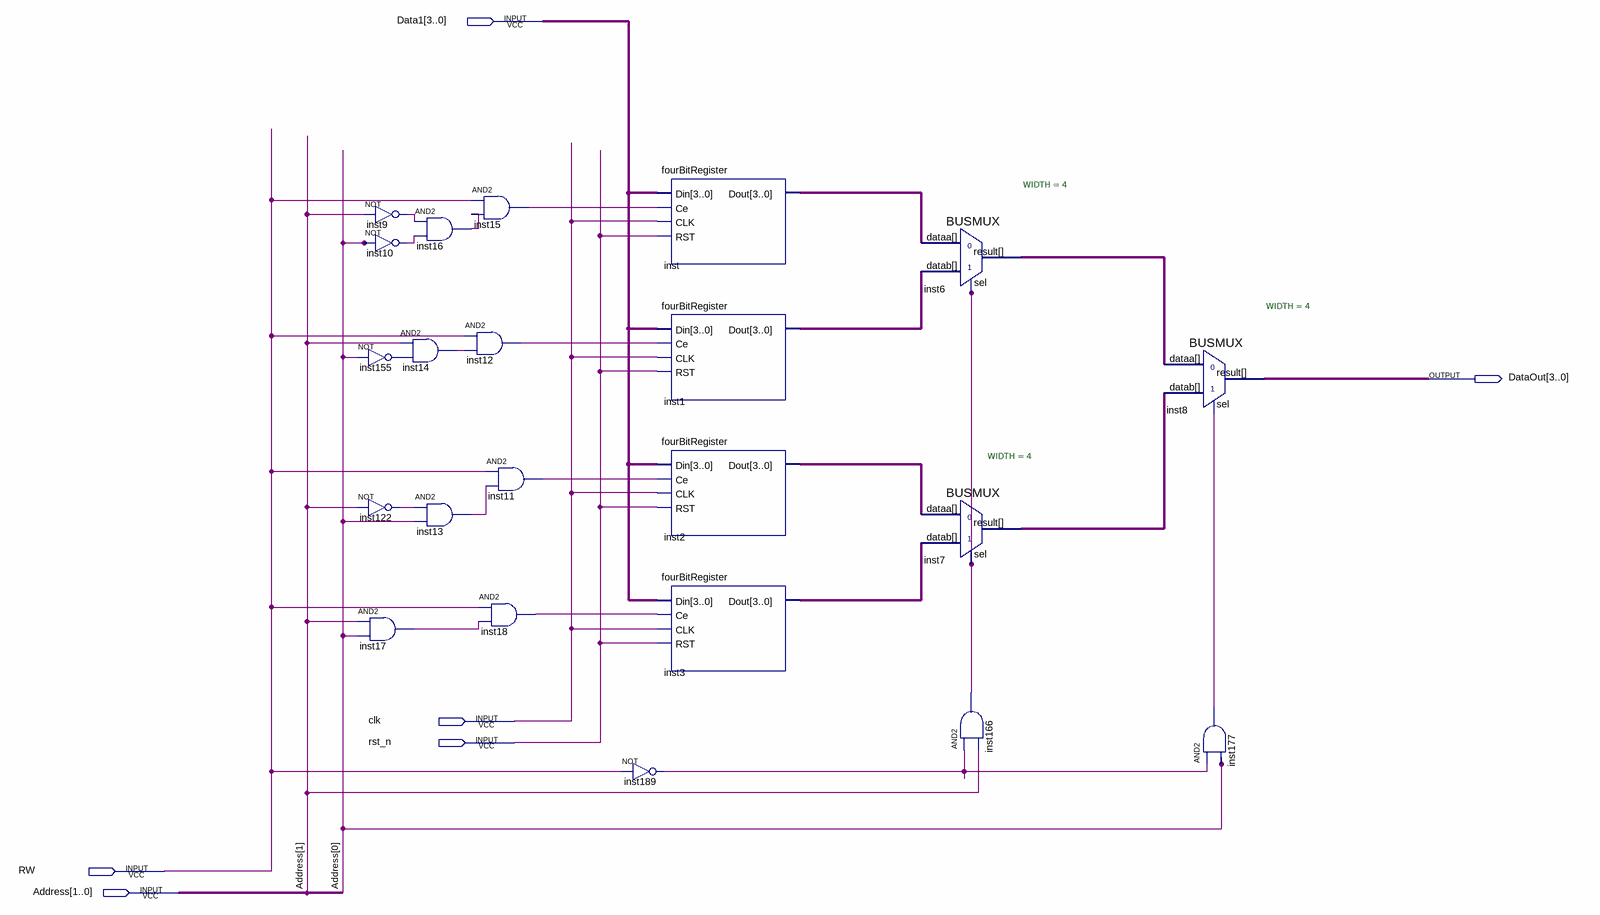
[diagram p0: schematic sheet]
// Quartus schematic ex2.bdf as structural Verilog: 22 symbols, 6 pins
module ex2 (
  input  [3:0] Data1,
  input  clk,
  input  rst_n,
  input  RW,
  input  [1:0] Address,
  output [3:0] DataOut
);

  wire inst9_out, inst10_out, inst11_out, inst12_out, inst13_out, inst14_out, inst15_out, inst16_out,
       inst17_out, inst18_out, inst122_out, inst155_out, inst166_out, inst177_out, inst189_out;
  wire [3:0] inst1_dout, inst2_dout, inst3_dout, inst6_result, inst7_result, inst_dout;

  not inst9 (inst9_out, Address[1]);
  not inst10 (inst10_out, Address[0]);
  not inst155 (inst155_out, Address[0]);
  not inst122 (inst122_out, Address[1]);
  and inst17 (inst17_out, Address[1], Address[0]);
  and inst16 (inst16_out, inst9_out, inst10_out);
  and inst14 (inst14_out, Address[1], inst155_out);
  and inst13 (inst13_out, inst122_out, Address[0]);
  and inst15 (inst15_out, RW, inst16_out);
  and inst12 (inst12_out, RW, inst14_out);
  and inst11 (inst11_out, RW, inst13_out);
  and inst18 (inst18_out, RW, inst17_out);
  fourBitRegister inst (.Din(Data1), .Ce(inst15_out), .CLK(clk), .RST(rst_n), .Dout(inst_dout));
  fourBitRegister inst1 (.Din(Data1), .Ce(inst12_out), .CLK(clk), .RST(rst_n), .Dout(inst1_dout));
  fourBitRegister inst2 (.Din(Data1), .Ce(inst11_out), .CLK(clk), .RST(rst_n), .Dout(inst2_dout));
  fourBitRegister inst3 (.Din(Data1), .Ce(inst18_out), .CLK(clk), .RST(rst_n), .Dout(inst3_dout));
  not inst189 (inst189_out, RW);
  BUSMUX #(.WIDTH(4)) inst6 (.datab(inst1_dout), .sel(inst166_out), .dataa(inst_dout), .result(inst6_result));
  BUSMUX #(.WIDTH(4)) inst7 (.datab(inst3_dout), .sel(inst166_out), .dataa(inst2_dout), .result(inst7_result));
  and inst166 (inst166_out, inst189_out, Address[1]);
  BUSMUX #(.WIDTH(4)) inst8 (.datab(inst7_result), .sel(inst177_out), .dataa(inst6_result), .result(DataOut));
  and inst177 (inst177_out, inst189_out, Address[0]);
endmodule
